# Altium schematic sheet 19.IO_Connector.SchDoc: CM3 IO
size 386 x 246 mm; Page Create Date: March  8, 1995; Page Number: 19; Page Size: B; Comment: radxa_1010; Page Count: 20; RevCode: 1.36; Doc: IO_Connector; DsnPath: D:\WMS\黄工\[RC119]CM3_IO_V1.36\对外资料\radxa_cm3_io_board_v1360.DSN; SchematicName: CM3_IO V1.36; PageName: 19.IO_Connector; PageSize: B; TopSchematic: True
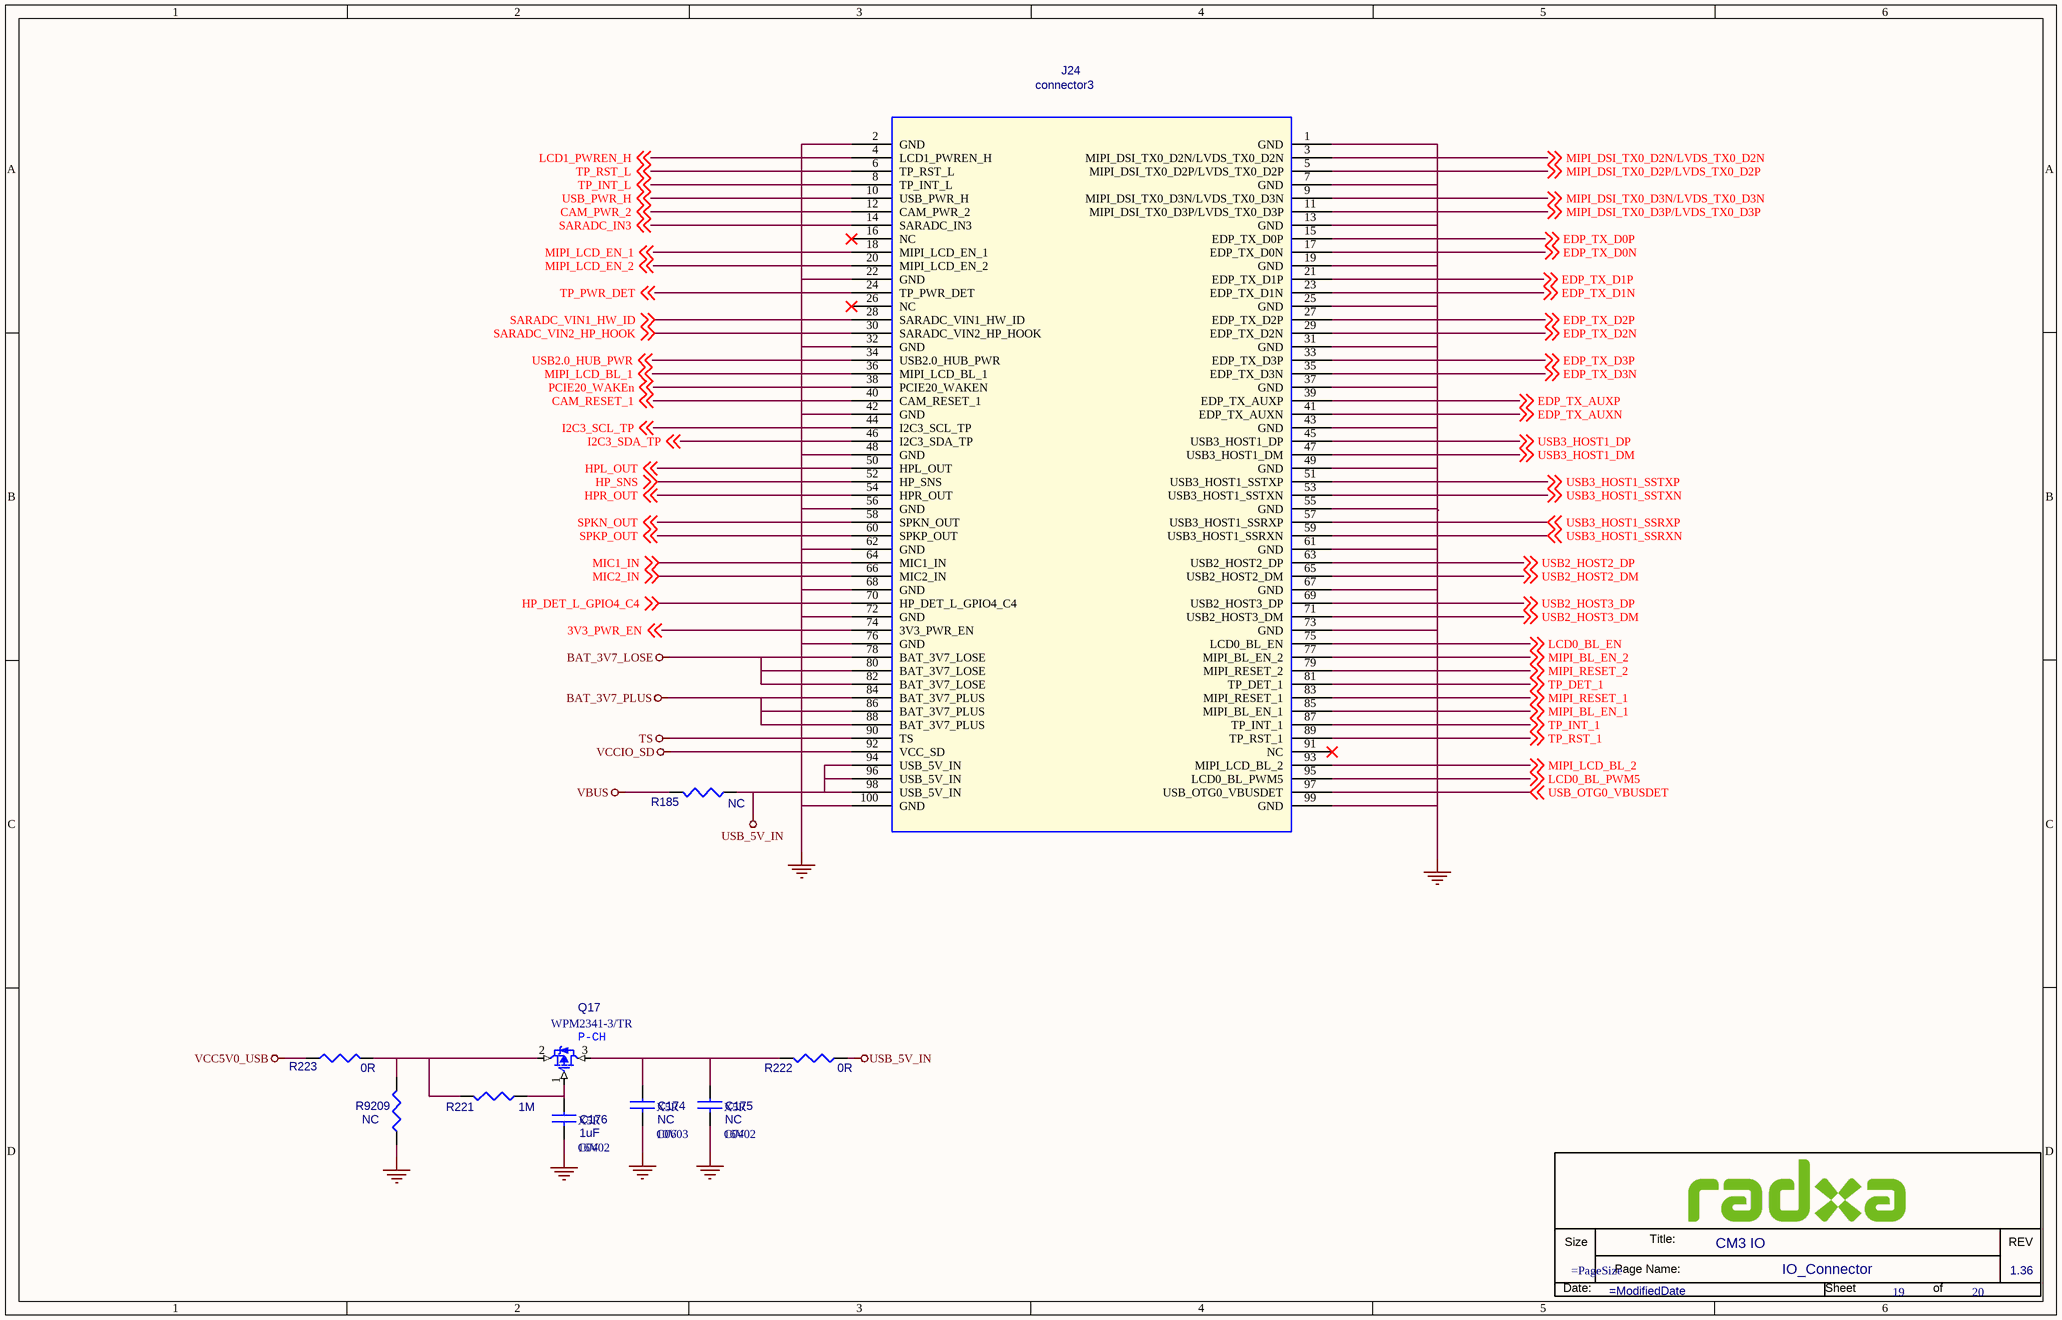
[diagram p0: 19.IO_Connector.SchDoc]

## Parts
*  Doc: IO_Connector  RevCode: 1.36  Title: CM3 IO  Page Number: 19  Page Count: 20  (hidden comment: radxa_1010)  (graphical)
C174  NC  Voltage: 10V  Dielectric: X5R  [C0603]
C175  NC  Voltage: 16V  Dielectric: X5R  [C0402]
C176  1uF  Voltage: 16V  Dielectric: X5R  [C0402]
J24  connector3  [DF40C_100DS]
Q17  WPM2341-3/TR  [S0T-23]
R185  NC  [R0603]
R221  1M  [R0402]
R222  0R  [R0402]
R223  0R  [R0402]
R9209  NC  [R0402]

## Nets
BAT_3V7_LOSE: J24.78(BAT_3V7_LOSE) J24.80(BAT_3V7_LOSE) J24.82(BAT_3V7_LOSE)
BAT_3V7_PLUS: J24.84(BAT_3V7_PLUS) J24.86(BAT_3V7_PLUS) J24.88(BAT_3V7_PLUS)
GND: C174.2 C175.2 C176.2 J24.1(GND) J24.2(GND) J24.7(GND) J24.13(GND) J24.19(GND) J24.22(GND) J24.25(GND) J24.31(GND) J24.32(GND) J24.37(GND) J24.42(GND) J24.43(GND) J24.48(GND) J24.49(GND) J24.55(GND) J24.56(GND) J24.61(GND) J24.62(GND) J24.67(GND) J24.68(GND) J24.72(GND) J24.73(GND) J24.76(GND) J24.99(GND) J24.100(GND) R9209.2
TS: J24.90(TS)
USB_5V_IN: J24.94(USB_5V_IN) J24.96(USB_5V_IN) J24.98(USB_5V_IN) R185.2 R222.2
VBUS: R185.1
VCC5V0_USB: R223.1
VCCIO_SD: J24.92(VCC_SD)
3V3_PWR_EN: J24.74(3V3_PWR_EN) ; off-sheet 3V3_PWR_EN
CAM_PWR_2: J24.12(CAM_PWR_2) ; off-sheet CAM_PWR_2
CAM_RESET_1: J24.40(CAM_RESET_1) ; off-sheet CAM_RESET_1
EDP_TX_AUXN: J24.41(EDP_TX_AUXN) ; off-sheet EDP_TX_AUXN
EDP_TX_AUXP: J24.39(EDP_TX_AUXP) ; off-sheet EDP_TX_AUXP
EDP_TX_D0N: J24.17(EDP_TX_D0N) ; off-sheet EDP_TX_D0N
EDP_TX_D0P: J24.15(EDP_TX_D0P) ; off-sheet EDP_TX_D0P
EDP_TX_D1N: J24.23(EDP_TX_D1N) ; off-sheet EDP_TX_D1N
EDP_TX_D1P: J24.21(EDP_TX_D1P) ; off-sheet EDP_TX_D1P
EDP_TX_D2N: J24.29(EDP_TX_D2N) ; off-sheet EDP_TX_D2N
EDP_TX_D2P: J24.27(EDP_TX_D2P) ; off-sheet EDP_TX_D2P
EDP_TX_D3N: J24.35(EDP_TX_D3N) ; off-sheet EDP_TX_D3N
EDP_TX_D3P: J24.33(EDP_TX_D3P) ; off-sheet EDP_TX_D3P
HP_DET_L_GPIO4_C4: J24.70(HP_DET_L_GPIO4_C4) ; off-sheet HP_DET_L_GPIO4_C4
HP_SNS: J24.52(HP_SNS) ; off-sheet HP_SNS
HPL_OUT: J24.50(HPL_OUT) ; off-sheet HPL_OUT
HPR_OUT: J24.54(HPR_OUT) ; off-sheet HPR_OUT
I2C3_SCL_TP: J24.44(I2C3_SCL_TP) ; off-sheet I2C3_SCL_TP
I2C3_SDA_TP: J24.46(I2C3_SDA_TP) ; off-sheet I2C3_SDA_TP
LCD0_BL_EN: J24.75(LCD0_BL_EN) ; off-sheet LCD0_BL_EN
LCD0_BL_PWM5: J24.95(LCD0_BL_PWM5) ; off-sheet LCD0_BL_PWM5
LCD1_PWREN_H: J24.4(LCD1_PWREN_H) ; off-sheet LCD1_PWREN_H
MIC1_IN: J24.64(MIC1_IN) ; off-sheet MIC1_IN
MIC2_IN: J24.66(MIC2_IN) ; off-sheet MIC2_IN
MIPI_BL_EN_1: J24.85(MIPI_BL_EN_1) ; off-sheet MIPI_BL_EN_1
MIPI_BL_EN_2: J24.77(MIPI_BL_EN_2) ; off-sheet MIPI_BL_EN_2
MIPI_DSI_TX0_D2N/LVDS_TX0_D2N: J24.3(MIPI_DSI_TX0_D2N/LVDS_TX0_D2N) ; off-sheet MIPI_DSI_TX0_D2N/LVDS_TX0_D2N
MIPI_DSI_TX0_D2P/LVDS_TX0_D2P: J24.5(MIPI_DSI_TX0_D2P/LVDS_TX0_D2P) ; off-sheet MIPI_DSI_TX0_D2P/LVDS_TX0_D2P
MIPI_DSI_TX0_D3N/LVDS_TX0_D3N: J24.9(MIPI_DSI_TX0_D3N/LVDS_TX0_D3N) ; off-sheet MIPI_DSI_TX0_D3N/LVDS_TX0_D3N
MIPI_DSI_TX0_D3P/LVDS_TX0_D3P: J24.11(MIPI_DSI_TX0_D3P/LVDS_TX0_D3P) ; off-sheet MIPI_DSI_TX0_D3P/LVDS_TX0_D3P
MIPI_LCD_BL_1: J24.36(MIPI_LCD_BL_1) ; off-sheet MIPI_LCD_BL_1
MIPI_LCD_BL_2: J24.93(MIPI_LCD_BL_2) ; off-sheet MIPI_LCD_BL_2
MIPI_LCD_EN_1: J24.18(MIPI_LCD_EN_1) ; off-sheet MIPI_LCD_EN_1
MIPI_LCD_EN_2: J24.20(MIPI_LCD_EN_2) ; off-sheet MIPI_LCD_EN_2
MIPI_RESET_1: J24.83(MIPI_RESET_1) ; off-sheet MIPI_RESET_1
MIPI_RESET_2: J24.79(MIPI_RESET_2) ; off-sheet MIPI_RESET_2
PCIE20_WAKEn: J24.38(PCIE20_WAKEN) ; off-sheet PCIE20_WAKEn
SARADC_IN3: J24.14(SARADC_IN3) ; off-sheet SARADC_IN3
SARADC_VIN1_HW_ID: J24.28(SARADC_VIN1_HW_ID) ; off-sheet SARADC_VIN1_HW_ID
SARADC_VIN2_HP_HOOK: J24.30(SARADC_VIN2_HP_HOOK) ; off-sheet SARADC_VIN2_HP_HOOK
SPKN_OUT: J24.58(SPKN_OUT) ; off-sheet SPKN_OUT
SPKP_OUT: J24.60(SPKP_OUT) ; off-sheet SPKP_OUT
TP_DET_1: J24.81(TP_DET_1) ; off-sheet TP_DET_1
TP_INT_1: J24.87(TP_INT_1) ; off-sheet TP_INT_1
TP_INT_L: J24.8(TP_INT_L) ; off-sheet TP_INT_L
TP_PWR_DET: J24.24(TP_PWR_DET) ; off-sheet TP_PWR_DET
TP_RST_1: J24.89(TP_RST_1) ; off-sheet TP_RST_1
TP_RST_L: J24.6(TP_RST_L) ; off-sheet TP_RST_L
USB2.0_HUB_PWR: J24.34(USB2.0_HUB_PWR) ; off-sheet USB2.0_HUB_PWR
USB2_HOST2_DM: J24.65(USB2_HOST2_DM) ; off-sheet USB2_HOST2_DM
USB2_HOST2_DP: J24.63(USB2_HOST2_DP) ; off-sheet USB2_HOST2_DP
USB2_HOST3_DM: J24.71(USB2_HOST3_DM) ; off-sheet USB2_HOST3_DM
USB2_HOST3_DP: J24.69(USB2_HOST3_DP) ; off-sheet USB2_HOST3_DP
USB3_HOST1_DM: J24.47(USB3_HOST1_DM) ; off-sheet USB3_HOST1_DM
USB3_HOST1_DP: J24.45(USB3_HOST1_DP) ; off-sheet USB3_HOST1_DP
USB3_HOST1_SSRXN: J24.59(USB3_HOST1_SSRXN) ; off-sheet USB3_HOST1_SSRXN
USB3_HOST1_SSRXP: J24.57(USB3_HOST1_SSRXP) ; off-sheet USB3_HOST1_SSRXP
USB3_HOST1_SSTXN: J24.53(USB3_HOST1_SSTXN) ; off-sheet USB3_HOST1_SSTXN
USB3_HOST1_SSTXP: J24.51(USB3_HOST1_SSTXP) ; off-sheet USB3_HOST1_SSTXP
USB_OTG0_VBUSDET: J24.97(USB_OTG0_VBUSDET) ; off-sheet USB_OTG0_VBUSDET
USB_PWR_H: J24.10(USB_PWR_H) ; off-sheet USB_PWR_H
NetC174_1: C174.1 C175.1 Q17.3(D) R222.1
NetC176_1: C176.1 Q17.1(G) R221.1
NetQ17_2: Q17.2(S) R221.2 R223.2 R9209.1

Not connected (* = marked no-connect by the designer): J24 16(NC)* 26(NC)* 91(NC)*

## Notes on the sheet
- (in symbol P-MOSFET) P-CH
- (in symbol radxa_1010) Size; Title:; REV; Page Name:; Date:; Sheet; of

## Library data of the parts
C174 = CAP NP_0: cap,22.00uF,+/-10%,10V,X5R,C0805; Part Reference: C174; Manufacturer: TDK; RK PN: C2012X5R1A226K125AB; Priority: A; Tolerance: 10%; PCB Footprint: C0603; Value: NC; Part Type: C0805; Manufacturer PN: C2012X5R1A226K125AB; Created by: JJJ
C175 = CAP NP_0: cap,100.00nF,+/-10%,16V,X5R,C0402; Part Reference: C175; Manufacturer: TDK; RK PN: C1005X5R1C104K050BA; Priority: A; Tolerance: 10%; PCB Footprint: C0402; Value: NC; Part Type: C0402; Manufacturer PN: C1005X5R1C104K050BA; Created by: JJJ
C176 = CAP NP_0: cap,100.00nF,+/-10%,16V,X5R,C0402; Part Reference: C176; Manufacturer PN: C1005X5R1C104K050BA; Manufacturer: TDK; Tolerance: 10%; Priority: A; PCB Footprint: C0402; Value: 1uF; Created by: JJJ; Part Type: C0402; RK PN: C1005X5R1C104K050BA
J24 = CN_7: Part Reference: J24; Value: connector3; PCB Footprint: DF40C_100DS
Q17 = P-MOSFET: Part Reference: Q17; SANZ_P/N: SK2301; Value: WPM2341-3/TR; Part Type: MOS管; PCB Footprint: S0T-23
R185 = RESISTOR_0: 通用厚膜电阻,330R,+/-5%,R0402,1/16W.; Part Reference: R185; Manufacturer: YAGEO; RK PN: RC0402JR-07330RL; Priority: A; Tolerance: 5%; Wattage: 1/16W; Value: NC; Part Type: 通用厚膜电阻; Manufacturer PN: RC0402JR-07330RL; Created by: YTL; PCB Footprint: R0603
R221 = RESISTOR_1: RES,thick film,47KOhm,+/-5%,1/16W,SMD0402; Part Reference: R221; Value: 1M; PCB Footprint: R0402
R222 = RESISTOR_0: 通用厚膜电阻,330R,+/-5%,R0402,1/16W.; Part Reference: R222; Manufacturer PN: RC0402JR-07330RL; Manufacturer: YAGEO; Wattage: 1/16W; Tolerance: 5%; Priority: A; Value: 0R; Created by: YTL; Part Type: 通用厚膜电阻; RK PN: RC0402JR-07330RL; PCB Footprint: R0402
R223 = RESISTOR_0: 通用厚膜电阻,330R,+/-5%,R0402,1/16W.; Part Reference: R223; Manufacturer PN: RC0402JR-07330RL; Manufacturer: YAGEO; Wattage: 1/16W; Tolerance: 5%; Priority: A; Value: 0R; Created by: YTL; Part Type: 通用厚膜电阻; RK PN: RC0402JR-07330RL; PCB Footprint: R0402
R9209 = RESISTOR_0: 通用厚膜电阻,100R,+/-5%,R0402,1/16W.; Part Reference: R9209; Manufacturer PN: RC0402JR-07100RL; Manufacturer: YAGEO; Wattage: 1/16W; Tolerance: 5%; Priority: A; Value: NC; Created by: YTL; Part Type: 通用厚膜电阻; RK PN: RC0402JR-07100RL; PCB Footprint: R0402
* = radxa_1010: Page Create Date: March  8, 1995; Page Size: =PageSize; Page Modify Date: =ModifiedDate